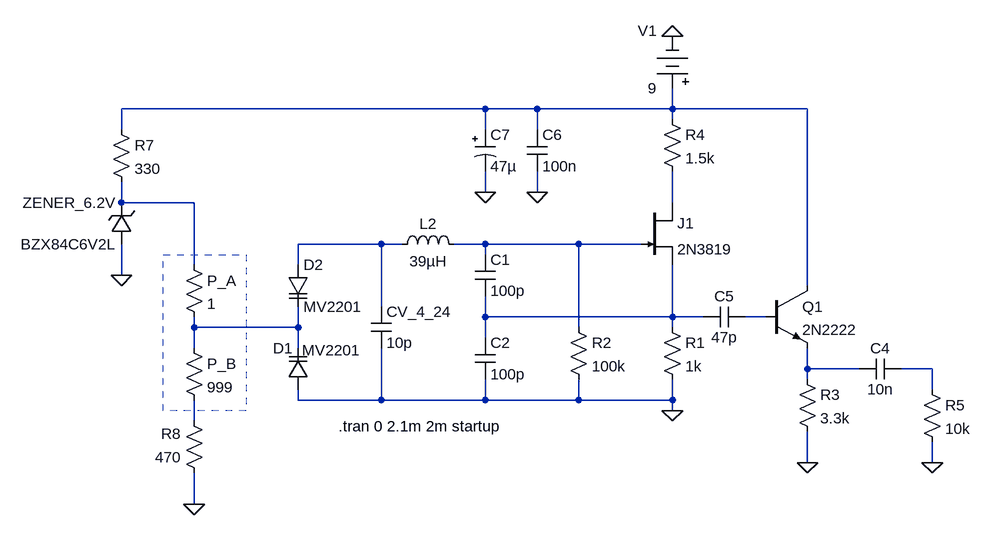
[diagram p0: schematic Draft1.asc]
Draft1.asc, the LTspice schematic file:
Version 4
SHEET 1 880 680
WIRE -128 -224 -688 -224
WIRE -48 -224 -128 -224
WIRE 160 -224 160 -256
WIRE 160 -224 -48 -224
WIRE 368 -224 160 -224
WIRE 160 -208 160 -224
WIRE -688 -192 -688 -224
WIRE -128 -192 -128 -224
WIRE -48 -192 -48 -224
WIRE -128 -96 -128 -128
WIRE -48 -96 -48 -128
WIRE -688 -80 -688 -112
WIRE -576 -80 -688 -80
WIRE 160 -80 160 -128
WIRE -288 -16 -416 -16
WIRE -256 -16 -288 -16
WIRE -128 -16 -176 -16
WIRE 16 -16 -128 -16
WIRE 112 -16 16 -16
WIRE -128 0 -128 -16
WIRE -576 16 -576 -80
WIRE -416 16 -416 -16
WIRE -688 32 -688 -16
WIRE 368 48 368 -224
WIRE -288 80 -288 -16
WIRE -128 96 -128 64
WIRE 160 96 160 16
WIRE 160 96 -128 96
WIRE 208 96 160 96
WIRE 304 96 272 96
WIRE -576 112 -576 96
WIRE -416 112 -416 80
WIRE -416 112 -576 112
WIRE 16 112 16 -16
WIRE 160 112 160 96
WIRE -128 128 -128 96
WIRE -576 144 -576 112
WIRE -416 144 -416 112
WIRE 368 176 368 144
WIRE 448 176 368 176
WIRE 560 176 512 176
WIRE 368 192 368 176
WIRE 560 208 560 176
WIRE -416 224 -416 208
WIRE -288 224 -288 144
WIRE -288 224 -416 224
WIRE -128 224 -128 192
WIRE -128 224 -288 224
WIRE 16 224 16 192
WIRE 16 224 -128 224
WIRE 160 224 160 192
WIRE 160 224 16 224
WIRE 160 240 160 224
WIRE -576 256 -576 224
WIRE 368 320 368 272
WIRE 560 320 560 288
WIRE -576 384 -576 336
FLAG 160 240 0
FLAG 160 -336 0
FLAG -576 384 0
FLAG 368 320 0
FLAG 560 320 0
FLAG -688 32 0
FLAG -48 -96 0
FLAG -128 -96 0
SYMBOL njf 112 -80 R0
SYMATTR InstName J1
SYMATTR Value 2N3819
SYMBOL res 144 96 R0
SYMATTR InstName R1
SYMATTR Value 1k
SYMBOL cap -144 0 R0
SYMATTR InstName C1
SYMATTR Value 100p
SYMBOL cap -144 128 R0
SYMATTR InstName C2
SYMATTR Value 100p
SYMBOL res 0 96 R0
SYMATTR InstName R2
SYMATTR Value 100k
SYMBOL cap -304 80 R0
SYMATTR InstName CV_4_24
SYMATTR Value 10p
SYMBOL ind -272 0 R270
WINDOW 0 32 56 VTop 2
WINDOW 3 5 56 VBottom 2
SYMATTR InstName L2
SYMATTR Value 39µH
SYMBOL Misc\\battery 160 -240 R180
WINDOW 0 24 104 Left 2
WINDOW 3 24 16 Left 2
SYMATTR InstName V1
SYMATTR Value 9
SYMBOL res 144 -224 R0
SYMATTR InstName R4
SYMATTR Value 1.5k
SYMBOL cap 272 80 R90
WINDOW 0 0 32 VBottom 2
WINDOW 3 32 32 VTop 2
SYMATTR InstName C5
SYMATTR Value 47p
SYMBOL varactor -400 208 R180
WINDOW 0 24 64 Left 2
WINDOW 3 -80 61 Left 2
SYMATTR InstName D1
SYMATTR Value MV2201
SYMATTR Type diode
SYMBOL varactor -432 16 R0
SYMATTR InstName D2
SYMATTR Value MV2201
SYMATTR Type diode
SYMBOL npn 304 48 R0
SYMATTR InstName Q1
SYMATTR Value 2N2222
SYMBOL res 352 176 R0
SYMATTR InstName R3
SYMATTR Value 3.3k
SYMBOL cap 512 160 R90
WINDOW 0 0 32 VBottom 2
WINDOW 3 32 32 VTop 2
SYMATTR InstName C4
SYMATTR Value 10n
SYMBOL res 544 192 R0
SYMATTR InstName R5
SYMATTR Value 10k
SYMBOL zener -672 -16 R180
WINDOW 0 24 64 Left 2
WINDOW 3 24 0 Left 2
SYMATTR InstName ZENER_6.2V
SYMATTR Value BZX84C6V2L
SYMBOL res -704 -208 R0
SYMATTR InstName R7
SYMATTR Value 330
SYMBOL res -560 352 R180
WINDOW 0 36 76 Left 2
WINDOW 3 36 40 Left 2
SYMATTR InstName R8
SYMATTR Value 470
SYMBOL res -592 128 R0
SYMATTR InstName P_B
SYMATTR Value 999
SYMBOL res -592 0 R0
SYMATTR InstName P_A
SYMATTR Value 1
SYMBOL cap -64 -192 R0
SYMATTR InstName C6
SYMATTR Value 100n
SYMBOL polcap -144 -192 R0
SYMATTR InstName C7
SYMATTR Value 47µ
TEXT -354 264 Left 2 !.tran 0 2.1m 2m startup
RECTANGLE Normal -496 240 -624 0 2

The netlist it stands for:
* Draft1.asc
J1 N003 N005 N006 2N3819
R1 N006 0 1k
C1 N005 N006 100p
C2 N006 0 100p
R2 N005 0 100k
CV_4_24 N004 0 10p
L2 N004 N005 39µH
V1 N001 0 9
R4 N001 N003 1.5k
C5 N007 N006 47p
D1 0 N008 MV2201
D2 N004 N008 MV2201
Q1 N001 N007 N009 0 2N2222
R3 N009 0 3.3k
C4 N010 N009 10n
R5 N010 0 10k
D§ZENER_6.2V 0 N002 BZX84C6V2L
R7 N001 N002 330
R8 0 N011 470
R§P_B N008 N011 999
R§P_A N002 N008 1
C6 N001 0 100n
C7 N001 0 47µ
.model D D
.lib standard.dio
.model NPN NPN
.model PNP PNP
.lib standard.bjt
.model NJF NJF
.model PJF PJF
.lib standard.jft
.tran 0 2.1m 2m startup
.backanno
.end